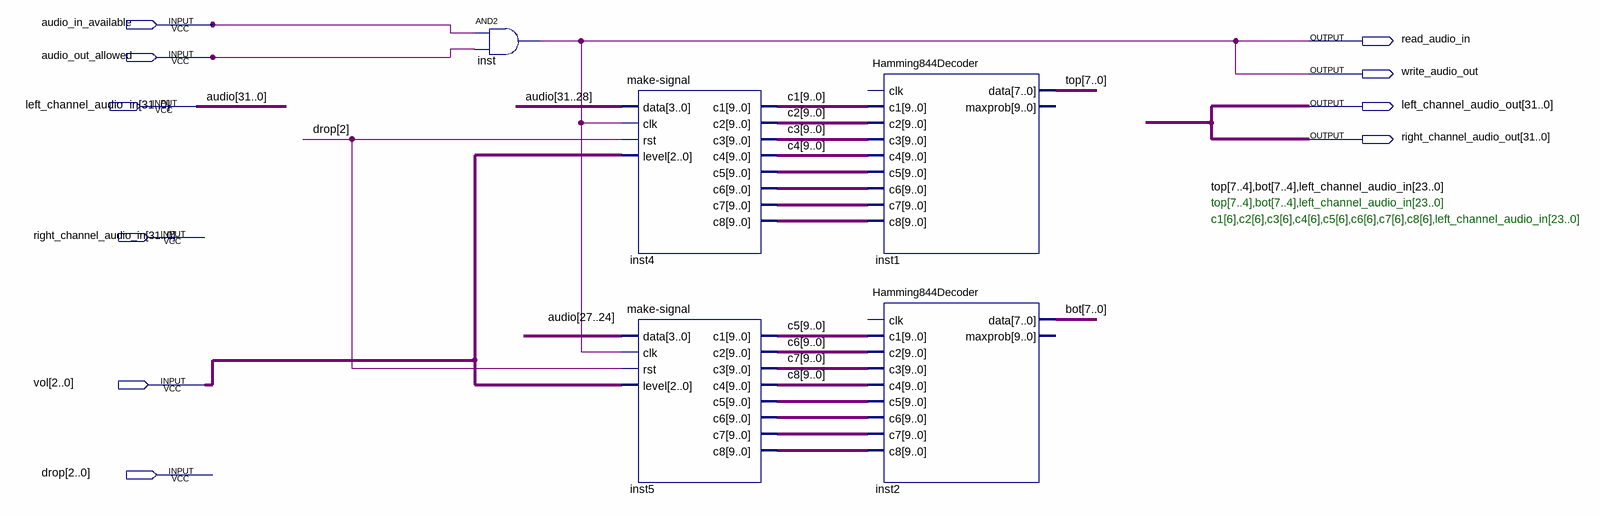
[diagram p0: schematic sheet]
// Quartus schematic filter_demo.bdf as structural Verilog: 5 symbols, 10 pins
module filter_demo (
  input  audio_in_available,
  input  audio_out_allowed,
  input  [31:0] left_channel_audio_in,
  input  [31:0] right_channel_audio_in,
  input  [2:0] vol,
  input  [2:0] drop,
  output read_audio_in,
  output write_audio_out,
  output [31:0] left_channel_audio_out,
  output [31:0] right_channel_audio_out
);

  wire [3:0] bot, top;
  wire [9:0] c1, c2, c3, c4, c5, c6, c7, c8, inst4_c5, inst4_c6, inst4_c7, inst4_c8, inst5_c5, inst5_c6,
       inst5_c7, inst5_c8;

  and inst (read_audio_in, audio_in_available, audio_out_allowed);
  \make-signal  inst4 (
    .data(left_channel_audio_in[31:28]), .clk(read_audio_in), .rst(drop[2]), .level(vol), .c1(c1), .c2(c2),
    .c3(c3), .c4(c4), .c5(inst4_c5), .c6(inst4_c6), .c7(inst4_c7), .c8(inst4_c8));
  \make-signal  inst5 (
    .data(left_channel_audio_in[27:24]), .clk(read_audio_in), .rst(drop[2]), .level(vol), .c1(c5), .c2(c6),
    .c3(c7), .c4(c8), .c5(inst5_c5), .c6(inst5_c6), .c7(inst5_c7), .c8(inst5_c8));
  Hamming844Decoder inst1 (
    .c1(c1), .c2(c2), .c3(c3), .c4(c4), .c5(inst4_c5), .c6(inst4_c6), .c7(inst4_c7), .c8(inst4_c8),
    .data({left_channel_audio_out[31:28], top}));  // open: clk, maxprob
  Hamming844Decoder inst2 (
    .c1(c5), .c2(c6), .c3(c7), .c4(c8), .c5(inst5_c5), .c6(inst5_c6), .c7(inst5_c7), .c8(inst5_c8),
    .data({left_channel_audio_out[27:24], bot}));  // open: clk, maxprob

  assign left_channel_audio_out[23:0] = left_channel_audio_in[23:0];
  assign right_channel_audio_out = {left_channel_audio_out[31:24], left_channel_audio_in[23:0]};
  assign write_audio_out = read_audio_in;

  // Other names for the same wires on the sheet: audio[31:0] = left_channel_audio_in;
  //   bot[7:4] = left_channel_audio_out[27:24]; top[7:4] = left_channel_audio_out[31:28]

  // Notes on the sheet:
  //   top[7..4],bot[7..4],left_channel_audio_in[23..0]
  //   c1[6],c2[6],c3[6],c4[6],c5[6],c6[6],c7[6],c8[6],left_channel_audio_in[23..0]
endmodule
